# Altium project sar20-baseboard.PrjPcb (part 1 of 2)
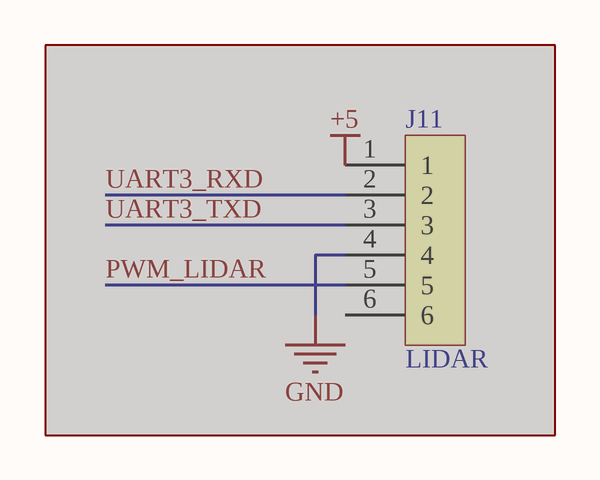
[diagram p0: sar20-baseboard.SchDoc]
6 sheets, 184 parts. Net scope: global (net labels, ports and power ports of the same name join across sheets).
Board files: sar20-baseboard.PcbDoc, sar20-baseboard-panel.PcbDoc
Sheets:
  sar20-baseboard.SchDoc
  sar20-baseboard-USB.SchDoc
  sar20-baseboard-SOM.SchDoc
  sar20-baseboard-MCU.SchDoc
  sar20-baseboard-Camera.SchDoc
  sar20-baseboard-Power.SchDoc

## Sheet sar20-baseboard.SchDoc
size A4

### Parts
J11  LIDAR  [MICRO-MATCH-FOB-SMD-06]  (masked out: inside a compile mask, not in the netlist)

### Library data of the parts
J11 = HEADER-6

## Sheet sar20-baseboard-USB.SchDoc
size A3
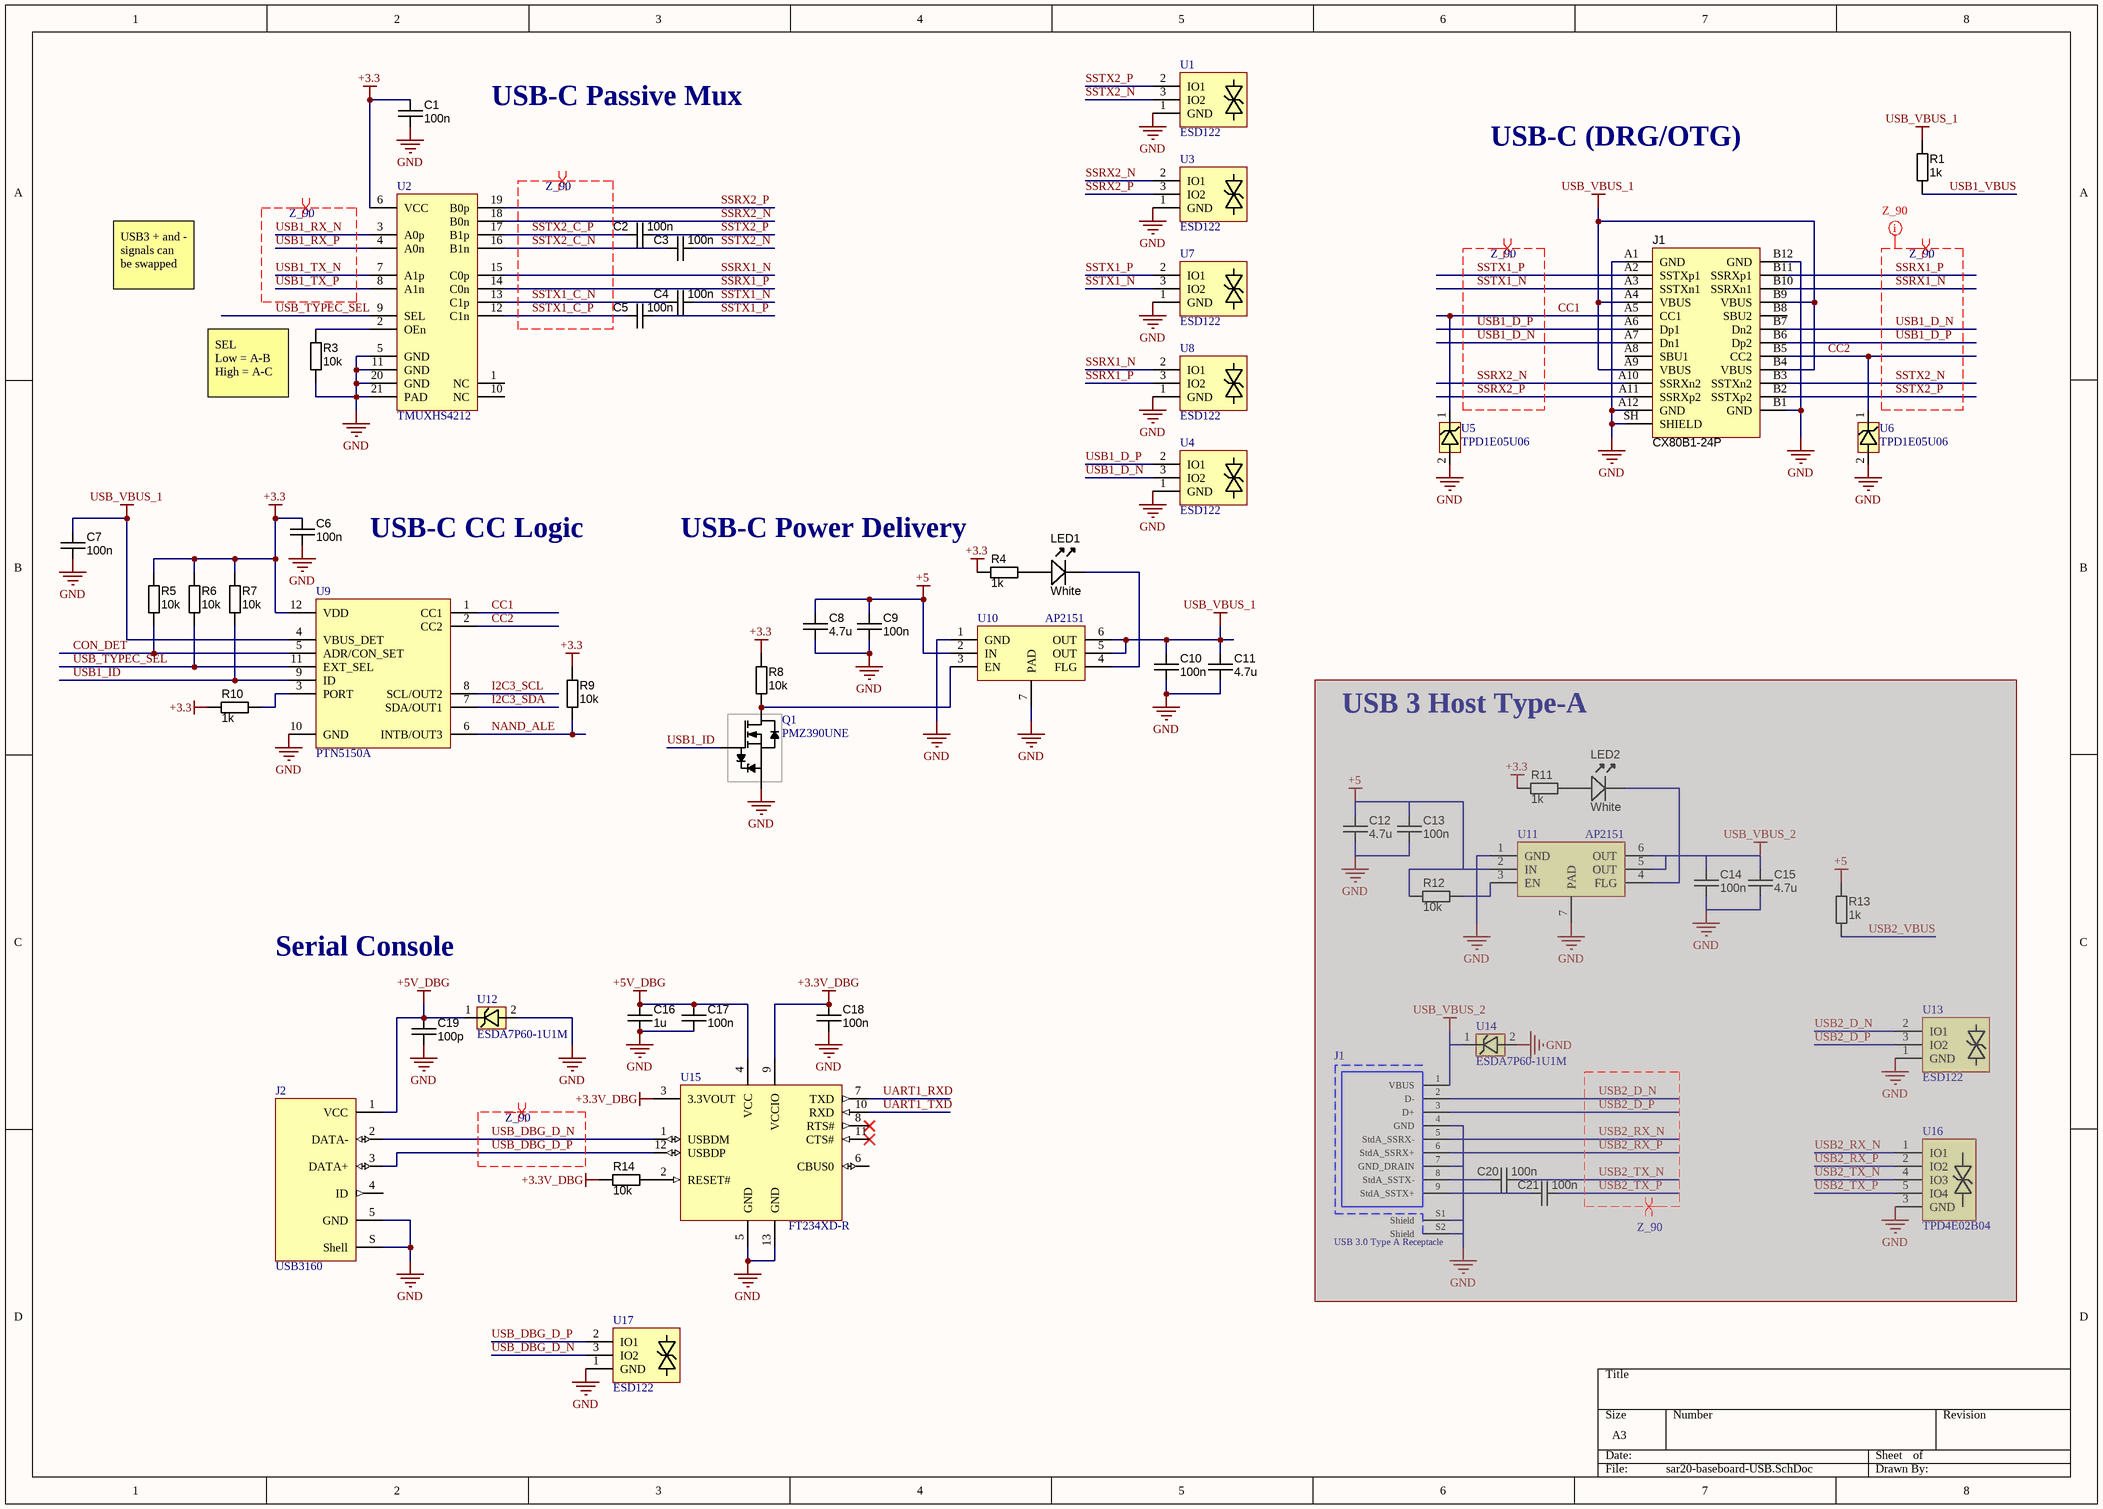
[diagram p1: sar20-baseboard-USB.SchDoc]

### Parts
(Parts that share a designator on the sheet are numbered #1, #2 ... from top to bottom, then left to right.)
C1  value 100n  [CAPC0603X04N]  (hidden comment: CAPC_100n_0201)
C2  value 100n  [CAPC0603X04N]  (hidden comment: CAPC_100n_0201)
C3  value 100n  [CAPC0603X04N]  (hidden comment: CAPC_100n_0201)
C4  value 100n  [CAPC0603X04N]  (hidden comment: CAPC_100n_0201)
C5  value 100n  [CAPC0603X04N]  (hidden comment: CAPC_100n_0201)
C6  100n  [CAPC1005X55N]
C7  100n  [CAPC1005X55N]
C8  value 4.7u  [CAPC1608X90N]  (hidden comment: approved sub OK)
C9  100n  [CAPC1005X55N]
C10  100n  [CAPC1005X55N]
C11  value 4.7u  [CAPC1608X90N]  (hidden comment: approved sub OK)
C12#1  value 4.7u  [CAPC1608X90N]  (hidden comment: approved sub OK)  (masked out: inside a compile mask, not in the netlist)
C13#1  100n  [CAPC1005X55N]  (masked out: inside a compile mask, not in the netlist)
C14#1  100n  [CAPC1005X55N]  (masked out: inside a compile mask, not in the netlist)
C15#1  value 4.7u  [CAPC1608X90N]  (hidden comment: approved sub OK)  (masked out: inside a compile mask, not in the netlist)
C16  1u  [CAPC1005X55N]
C17  value 100n  [CAPC0603X04N]  (hidden comment: CAPC_100n_0201)
C18  value 100n  [CAPC0603X04N]  (hidden comment: CAPC_100n_0201)
C19  value 100p  [CAPC0603X04N]  (hidden comment: CAPC_100n_0201)
C20#1  100n  [CAPC1005X55N]  (masked out: inside a compile mask, not in the netlist)
C21#1  100n  [CAPC1005X55N]  (masked out: inside a compile mask, not in the netlist)
J1#1  CX80B1-24P  [CX80B1-24P]
J1#2  USB 3.0 Type A Receptacle  [692121430000]  (masked out: inside a compile mask, not in the netlist)
J2  USB3160  [USB3160-XX-XXXX-X-X_revA]
LED1  White  [LED-0603-WHITE]
LED2  White  [LED-0603-WHITE]  (masked out: inside a compile mask, not in the netlist)
Q1  PMZ390UNE  [DFN1006-3_SOT883]
R1  value 1k  [RESC1005X40N]  (hidden comment: Thick Film)
R3  value 10k  [RESC1005X40N]  (hidden comment: Thick Film)
R4  value 1k  [RESC1005X40N]  (hidden comment: Thick Film)
R5  value 10k  [RESC1005X40N]  (hidden comment: Thick Film)
R6  value 10k  [RESC1005X40N]  (hidden comment: Thick Film)
R7  value 10k  [RESC1005X40N]  (hidden comment: Thick Film)
R8  value 10k  [RESC1005X40N]  (hidden comment: Thick Film)
R9  value 10k  [RESC1005X40N]  (hidden comment: Thick Film)
R10  value 1k  [RESC1005X40N]  (hidden comment: Thick Film)
R11#1  value 1k  [RESC1005X40N]  (hidden comment: Thick Film)  (masked out: inside a compile mask, not in the netlist)
R12#1  value 10k  [RESC1005X40N]  (hidden comment: Thick Film)  (masked out: inside a compile mask, not in the netlist)
R13#1  value 1k  [RESC1005X40N]  (hidden comment: Thick Film)  (masked out: inside a compile mask, not in the netlist)
R14  value 10k  [RESC0603X03N]  (hidden comment: RESC_0201)
U1  ESD122  [TI_X2SON_DMX0003A]
U2  TMUXHS4212  [TI_VQFN_RKS0020A]
U3  ESD122  [TI_X2SON_DMX0003A]
U4  ESD122  [TI_X2SON_DMX0003A]
U5  TPD1E05U06  [TI_X1SON_DPY]
U6  TPD1E05U06  [TI_X1SON_DPY]
U7  ESD122  [TI_X2SON_DMX0003A]
U8  ESD122  [TI_X2SON_DMX0003A]
U9  PTN5150A  [NXP_X2QFN12_SOT1355-1]
U10  AP2151  [SON50P200X60_HS-7N]
U11#1  AP2151  [SON50P200X60_HS-7N]  (masked out: inside a compile mask, not in the netlist)
U12  ESDA7P60-1U1M  [DFN105P160X60-2N]
U13#1  ESD122  [TI_X2SON_DMX0003A]  (masked out: inside a compile mask, not in the netlist)
U14#1  ESDA7P60-1U1M  [DFN105P160X60-2N]  (masked out: inside a compile mask, not in the netlist)
U15  FT234XD-R  [DFN-12_V]
U16#1  TPD4E02B04  [TI_USON10_DQA0010A_PASS]  (masked out: inside a compile mask, not in the netlist)
U17  ESD122  [TI_X2SON_DMX0003A]

### Nets
+3.3: C1.2 C6.1 R4.2 R5.2 R6.2 R7.2 R8.2 R9.2 R10.2 U2.6(VCC) U9.12(VDD)
+3.3V_DBG: C18.2 R14.1 U15.3(3.3VOUT) U15.9(VCCIO)
+5: C8.1 C9.1 U10.2(IN)
+5V_DBG: C16.1 C17.2 C19.2 J2.1(VCC) U12.1 U15.4(VCC)
GND: C1.1 C6.2 C7.2 C8.2 C9.2 C10.2 C11.2 C16.2 C17.1 C18.1 C19.1 J1#1.A1(GND) J1#1.A12(GND) J1#1.B1(GND) J1#1.B12(GND) J1#1.SH(SHIELD) J2.5(GND) J2.S(Shell) Q1.2(S) R3.1 U1.1(GND) U2.5(GND) U2.11(GND) U2.20(GND) U2.21(PAD) U3.1(GND) U4.1(GND) U5.2 U6.2 U7.1(GND) U8.1(GND) U9.10(GND) U10.1(GND) U10.7(PAD) U12.2 U15.5(GND) U15.13(GND) U17.1(GND)
USB_VBUS_1: C7.1 C10.1 C11.1 J1#1.A4(VBUS) J1#1.A9(VBUS) J1#1.B4(VBUS) J1#1.B9(VBUS) R1.2 U9.4(VBUS_DET) U10.5(OUT) U10.6(OUT)
CC1: J1#1.A5(CC1) U5.1 U9.1(CC1)
CC2: J1#1.B5(CC2) U6.1 U9.2(CC2)
CON_DET: R5.1 U9.5(ADR/CON_SET)
I2C3_SCL: U9.8(SCL/OUT2)
I2C3_SDA: U9.7(SDA/OUT1)
NAND_ALE: R9.1 U9.6(INTB/OUT3)
SSRX1_N: J1#1.B10(SSRXn1) U2.15(C0p) U8.2(IO1)
SSRX1_P: J1#1.B11(SSRXp1) U2.14(C0n) U8.3(IO2)
SSRX2_N: J1#1.A10(SSRXn2) U2.18(B0n) U3.2(IO1)
SSRX2_P: J1#1.A11(SSRXp2) U2.19(B0p) U3.3(IO2)
SSTX1_C_N: C4.1 U2.13(C1p)
SSTX1_C_P: C5.1 U2.12(C1n)
SSTX1_N: C4.2 J1#1.A3(SSTXn1) U7.3(IO2)
SSTX1_P: C5.2 J1#1.A2(SSTXp1) U7.2(IO1)
SSTX2_C_N: C3.1 U2.16(B1n)
SSTX2_C_P: C2.1 U2.17(B1p)
SSTX2_N: C3.2 J1#1.B3(SSTXn2) U1.3(IO2)
SSTX2_P: C2.2 J1#1.B2(SSTXp2) U1.2(IO1)
UART1_RXD: U15.7(TXD)
UART1_TXD: U15.10(RXD)
USB1_D_N: J1#1.A7(Dn1) J1#1.B7(Dn2) U4.3(IO2)
USB1_D_P: J1#1.A6(Dp1) J1#1.B6(Dp2) U4.2(IO1)
USB1_ID: Q1.1(G) R7.1 U9.9(ID)
USB1_RX_N: U2.3(A0p)
USB1_RX_P: U2.4(A0n)
USB1_TX_N: U2.7(A1p)
USB1_TX_P: U2.8(A1n)
USB1_VBUS: R1.1
USB_DBG_D_N: J2.2(DATA-) U15.1(USBDM) U17.3(IO2)
USB_DBG_D_P: J2.3(DATA+) U15.12(USBDP) U17.2(IO1)
USB_TYPEC_SEL: R6.1 U2.9(SEL) U9.11(EXT_SEL)
NetLED1_A: LED1.A R4.1
NetLED1_K: LED1.K U10.4(FLG)
NetQ1_3: Q1.3(D) R8.1 U10.3(EN)
NetR3_2: R3.2 U2.2(OEn)
NetR10_1: R10.1 U9.3(PORT)
NetR14_2: R14.2 U15.2(RESET#)

Not connected (* = marked no-connect by the designer): J1#1 A8(SBU1) B8(SBU2); J2 4(ID); U2 1(NC) 10(NC); U15 6(CBUS0) 8(RTS#)* 11(CTS#)*

### Layout directives
differential pair; differential pair class Z_90: SSRX1_N, SSRX1_P, SSRX2_N, SSRX2_P, SSTX1_C_N, SSTX1_C_P, SSTX1_N, SSTX1_P, SSTX2_C_N, SSTX2_C_P, SSTX2_N, SSTX2_P, USB1_D_N, USB1_D_P, USB1_RX_N, USB1_RX_P, USB1_TX_N, USB1_TX_P, USB2_D_N, USB2_D_P, USB2_RX_N, USB2_RX_P, USB2_TX_N, USB2_TX_P, USB_DBG_D_N, USB_DBG_D_P
net class Z_90: SSRX1_N, SSRX1_P, SSTX2_N, SSTX2_P, USB1_D_N, USB1_D_P

### Notes on the sheet
- USB-C Passive Mux
- USB-C (DRG/OTG)
- USB3 + and - signals can be swapped
- (near R3) SEL
  Low = A-B
  High = A-C
- USB-C CC Logic
- (near R4) USB-C Power Delivery
- USB 3 Host Type-A
- Serial Console

### Library data of the parts
C6 C7 C9 C10 C13#1 C14#1 C20#1 C21#1 = CAPC_100n_0402_X5R_16V_10%: Capacitor SMD Cer 100nF 10% 16V X5R 0402; Manufacturer 1: AVX Corporation; Manufacturer Part Number 1: 0402YD104KAT2A; Ratings: 16V; X5R; SCDType: spec; Tolerance: ±10%; Operating Temperature: -55°C ~ 125°C; Package / Case: 0402 (1005 Metric); Size / Dimension: 0.039" L x 0.020" W (1.00mm x 0.50mm); Supplier 1: Digi-Key; Supplier Part Number 1: 478-1126-1-ND; ComponentLink1URL: http://www.avx.com/docs/Catalogs/cx5r.pdf; ComponentLink1Description: http://www.avx.com/docs/Catalogs/cx5r.pdf; Supplier 2: Digi-Key; Supplier Part Number 2: 311-1347-1-ND; Manufacturer 2: Yageo; Manufacturer Part Number 2: CC0402KRX5R7BB104; ComponentLink2URL: http://www.yageo.com/documents/recent/UPY-GPHC_X5R_4V-to-50V_12.pdf; ComponentLink2Description: http://www.yageo.com/documents/recent/UPY-GPHC_X5R_4V-to-50V_12.pdf; Value: 100n
C8 C11 C12#1 C15#1 = CAPC_2u2_0603_10V_10%: Capacitor SMD Cer 2.2uF 10% 10V X5R 0603; Manufacturer 1: AVX Corporation; Manufacturer Part Number 1: 0603ZD225KAT2A; Ratings: 10V; X5R; Material: ceramic; SCDType: spec; Package / Case: 0603 (1608 metric); Tolerance: ±10%; Supplier 1: Digi-Key; Supplier Part Number 1: 478-6212-1-ND; ComponentLink1URL: http://www.avx.com/docs/Catalogs/cx5r.pdf; ComponentLink1Description: http://www.avx.com/docs/Catalogs/cx5r.pdf
C16 = CAPC_1u_0402_X5R_6V3_10%: Capacitor SMD Cer 1uF 10% 16V X5R 0402; Manufacturer 1: AVX Corporation; Manufacturer Part Number 1: 04026D105KAT2A; Ratings: 6.3V; X5R; SCDType: spec; Tolerance: ±10%; Operating Temperature: -55°C ~ 125°C; Package / Case: 0402 (1005 Metric); Size / Dimension: 0.039" L x 0.020" W (1.00mm x 0.50mm); Supplier 1: Digi-Key; Supplier Part Number 1: 478-2583-1-ND; RoHS 1: RoHS Compliant; ComponentLink1URL: http://www.avx.com/docs/Catalogs/cx5r.pdf; ComponentLink1Description: http://www.avx.com/docs/Catalogs/cx5r.pdf; Supplier 2: Digi-Key; Supplier Part Number 2: 311-1438-1-ND; Manufacturer 2: Yageo; Manufacturer Part Number 2: CC0402KRX5R5BB105; RoHS 2: RoHS Compliant; ComponentLink2URL: http://www.yageo.com/documents/recent/UPY-GPHC_X5R_4V-to-50V_12.pdf; ComponentLink2Description: http://www.yageo.com/documents/recent/UPY-GPHC_X5R_4V-to-50V_12.pdf; Supplier 3: Digi-Key; Supplier Part Number 3: 1276-1010-1-ND; Manufacturer 3: Samsung Electro-Mechanics America, Inc; Manufacturer Part Number 3: CL05A105KQ5NNNC; RoHS 3: RoHS Compliant; ComponentLink3URL: http://www.samsungsem.com/servlet/FileDownload?path=productsearch&sname=CL05A105KQ5NNNC.pdf&oname=CL05A105KQ5NNNC.pdf; ComponentLink3Description: http://www.samsungsem.com/servlet/FileDownload?path=productsearch&sname=CL05A105KQ5NNNC.pdf&oname=CL05A105KQ5NNNC.pdf; Supplier 4: Digi-Key; Supplier Part Number 4: 445-4998-1-ND; Manufacturer 4: TDK Corporation; Manufacturer Part Number 4: C1005X5R0J105K050BB; RoHS 4: RoHS Compliant; ComponentLink4URL: http://product.tdk.com/capacitor/mlcc/en/documents/mlcc_commercial_general_en.pdf; ComponentLink4Description: http://product.tdk.com/capacitor/mlcc/en/documents/mlcc_commercial_general_en.pdf; Supplier 5: Digi-Key; Supplier Part Number 5: 490-1320-1-ND; Manufacturer 5: Murata Electronics North America; Manufacturer Part Number 5: GRM155R60J105KE19D; RoHS 5: RoHS Compliant; ComponentLink5URL: http://www.murata.com/products/catalog/pdf/c02e.pdf; ComponentLink5Description: http://www.murata.com/products/catalog/pdf/c02e.pdf; Value: 1u
J1#2 = 692121430000: USB 3.0 Type A, Receptacle, Vertical, THT; Manufacturer: Wurth Elektronik; Rated Current: 1.8A; Pin Number: 9; Interface Type: Type A; Working Voltage: 30VAC; ComponentLink1Description: Manufacturer; ComponentLink1URL: http://www.we-online.de; ComponentLink2Description: Datasheet; ComponentLink2URL: https://katalog.we-online.com/em/datasheet/692121430000.pdf; Published Date: September 2019; Manufacturer Part Number: 692121430000; Gender: Receptacle; Type: Vertical; Packaging: Tray; Operating Temperature: -20 to +85degC; Mounting Technology: THT; Application: USB 3.0
J2 = USB3160-XX-XXXX-X-X_revA: Micro USB Receptacle, Type B, SMT, Vertical, with Locating Peg, with Through-Hole Shell Stakes
LED1 LED2 = LED_SMD_White_0603_Bright: LED 0603 SMD Bright White 8700K; Manufacturer 1: Lite-On Inc; Manufacturer Part Number 1: LTW-C193TS5; Material: InGaN; Ratings: Ultra Bright; 8700K; Millicandela Rating: 230mcd; Voltage - Forward (Vf) Typ: 3.3V; Viewing Angle: 120°; Lens Type: Clear, Tinted; Lens Style/Size: Rectangle with Flat Top, 0.8mm x 1.1mm; Voltage - Forward (Vf) @ 10mA: 3.0V; SCDType: source; Package / Case: 0603 (1608 metric); Supplier 1: Digi-Key; Supplier Part Number 1: 160-1721-1-ND; Supplier 2: Digi-Key; Supplier Part Number 2: APT1608QWF/D-ND; Manufacturer 2: Kingbright Corp; Manufacturer Part Number 2: APT1608QWF/D; Color: White; Size / Dimension: 1.60mm L x 0.80mm W; Mounting Type: Surface Mount; Luminous Flux @ Current - Test: -; ComponentLink2URL: http://www.kingbrightusa.com/images/catalog/SPEC/APT1608QWF-D.pdf; ComponentLink2Description: http://www.kingbrightusa.com/images/catalog/SPEC/APT1608QWF-D.pdf; ComponentLink1URL: http://media.digikey.com/pdf/Data%20Sheets/Lite-On%20PDFs/LTW-C193TS5.pdf; ComponentLink1Description: http://media.digikey.com/pdf/Data%20Sheets/Lite-On%20PDFs/LTW-C193TS5.pdf
R1 R3-R10 R11#1 R12#1 R13#1 = RES_10K_0402_1%: Resistor SMD chip 10k Ohm 0.063W 1% 0402; Manufacturer 1: Vishay Dale; Manufacturer Part Number 1: CRCW040210K0FKED; Ratings: 1/16 W; SCDType: spec; Package / Case: 0402 (1005 Metric); Manufacturer 2: Yageo; Manufacturer Part Number 2: RC0402FR-0710KL; Supplier 1: Digi-Key; Supplier Part Number 1: 541-10.0KLCT-ND; ComponentLink1URL: http://www.vishay.com/doc?20035; ComponentLink1Description: http://www.vishay.com/doc?20035; Supplier 2: Digi-Key; Supplier Part Number 2: 311-10.0KLRCT-ND; ComponentLink2URL: http://www.yageo.com/documents/recent/PYu-RC0402_51_RoHS_L_6.pdf; ComponentLink2Description: http://www.yageo.com/documents/recent/PYu-RC0402_51_RoHS_L_6.pdf; Tolerance: ±1%
U10 U11#1 = AP2151_DFN: USB optimized power switch by Diodes Inc
U15 = FT234XD-R: FT234XD USB to BASIC UART IC, -40 to +85 degC, 12-Pin DFN, Pb-Free, Tape and Reel; Manufacturer: FTDI; DatasheetVersion: ver 1.1, Feb-2013; PackageVersion: Feb-13; PackageReference: DFN-12; PackageDescription: 12-Pin Dual Flat No-Lead, 3 x 3 mm Body, 0.45 mm Pitch, Exposed Pad; PartNumber: FT234XD-R; ComponentLink1Description: Manufacturer URL; ComponentLink1URL: http://www.ftdichip.com/; ComponentLink2Description: Datasheet; ComponentLink2URL: http://www.ftdichip.com/Support/Documents/DataSheets/ICs/DS_FT234XD.pdf

## Sheet sar20-baseboard-SOM.SchDoc
size A3
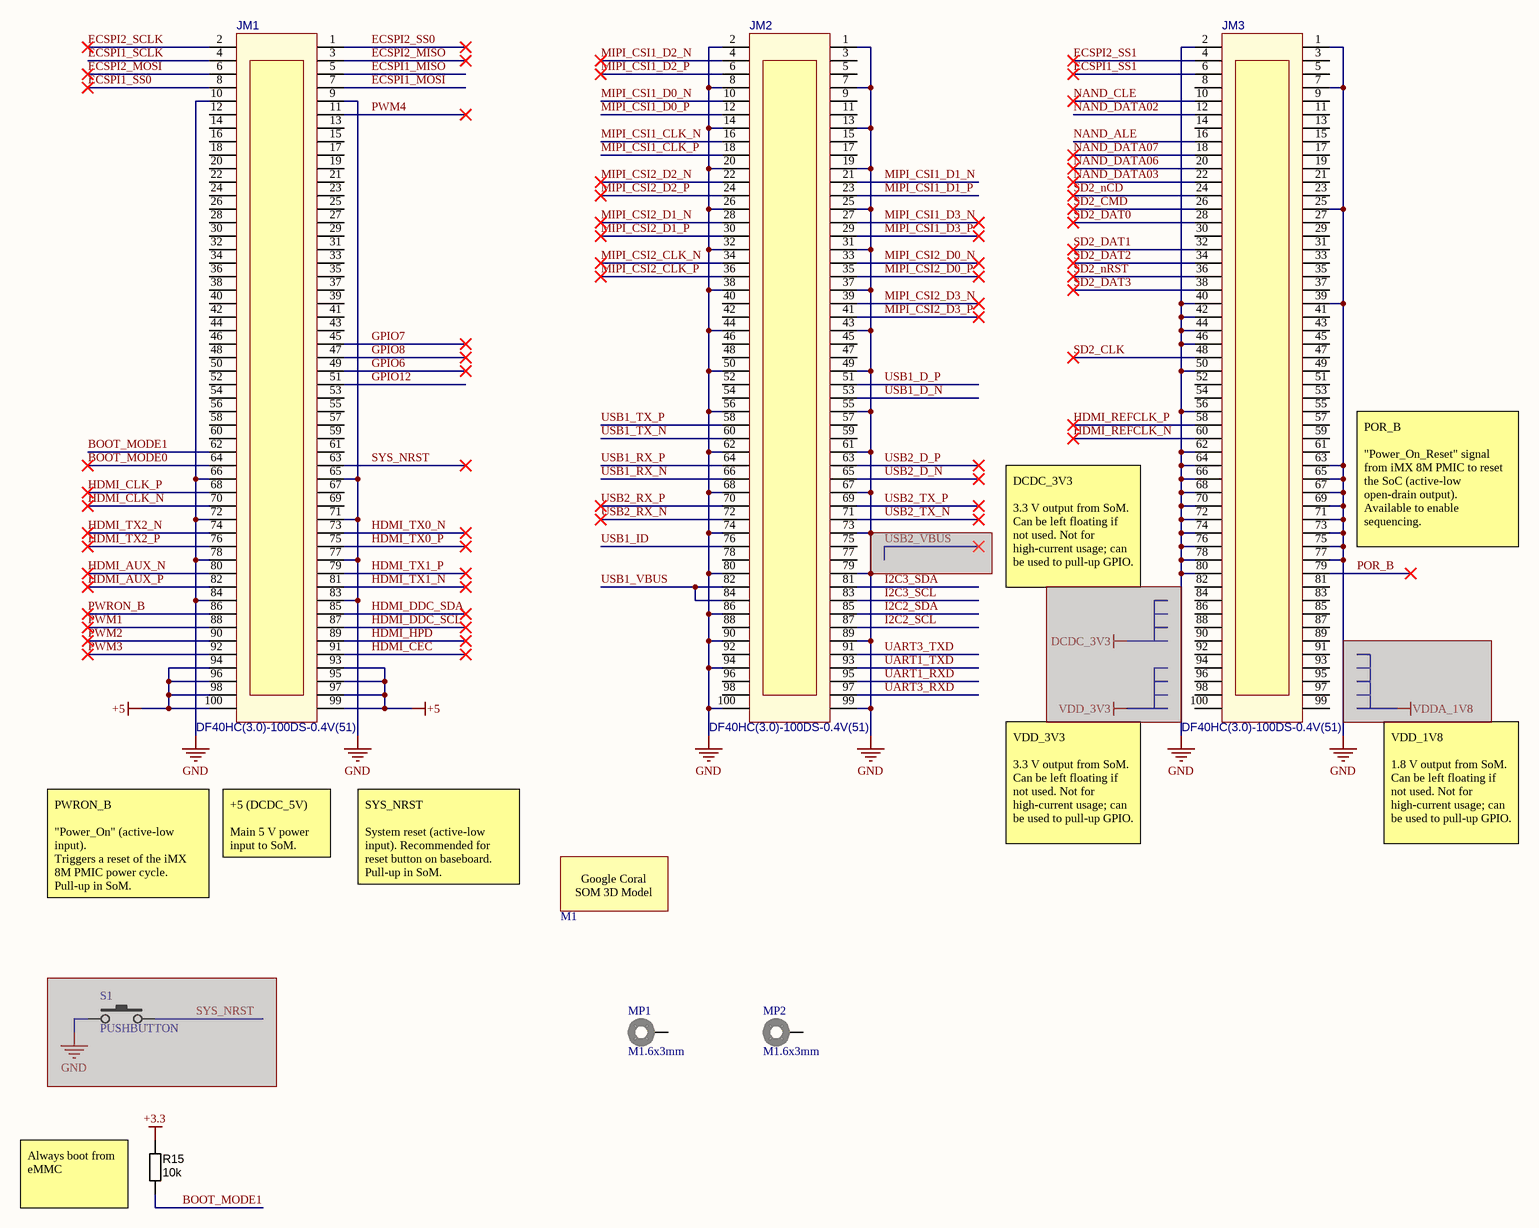
[diagram p2: sar20-baseboard-SOM.SchDoc]

### Parts
(Parts that share a designator on the sheet are numbered #1, #2 ... from top to bottom, then left to right.)
JM1  DF40HC(3.0)-100DS-0.4V(51)  [DF40HC(3.0)-100DS-0.4V(51)]
JM2  DF40HC(3.0)-100DS-0.4V(51)  [DF40HC(3.0)-100DS-0.4V(51)]
JM3  DF40HC(3.0)-100DS-0.4V(51)  [DF40HC(3.0)-100DS-0.4V(51)]
M1  Google Coral SOM  [CORAL-SOM]  (value not drawn)
MP1  M1.6x3mm  [9774030633]
MP2  M1.6x3mm  [9774030633]
R15  value 10k  [RESC1005X40N]  (hidden comment: Thick Film)
S1#1  PUSHBUTTON  [KMR421NGLFS]  (masked out: inside a compile mask, not in the netlist)

### Nets
+3.3: R15.1
+5: JM1.93(PB8) JM1.94(PB8) JM1.95(PB8) JM1.96(PB8) JM1.97(PB8) JM1.98(PB8) JM1.99(PB8) JM1.100(PB8)
GND: JM1.9(GND) JM1.10(PB15) JM1.65(PG6) JM1.66(BOOT1) JM1.71(PG12) JM1.72(PH12) JM1.77(GND) JM1.78(PI6) JM1.83(PB8) JM1.84(PB8) JM2.1(ETH_VDD) JM2.2 JM2.7(ETH_L1_C) JM2.8(GND) JM2.13(BATT_P) JM2.14(NRST) JM2.19(CHRG_NTC) JM2.20(PD14) JM2.25(PE8) JM2.26(PA8) JM2.31(PD5) JM2.32(PA10) JM2.37(PF0) JM2.38(PC11) JM2.43(PB3) JM2.44(PB4) JM2.49(PI2) JM2.50(BOOT0) JM2.55(PA11) JM2.56(PB7) JM2.61(PC7) JM2.62(PB12) JM2.67(PD3) JM2.68(PG11) JM2.73(PH13) JM2.74(PH8) JM2.79(PB8) JM2.80(ETH_R_N) JM2.86(PB8) JM2.89(PB8) JM2.90(PB8) JM2.94(PB8) JM2.99(PB8) JM2.100(PB8) JM3.1(ETH_VDD) JM3.2 JM3.7(ETH_L1_C) JM3.25(PE8) JM3.39(GND) JM3.40(PC12) JM3.42(PB10) JM3.44(PB4) JM3.46(PG9) JM3.50(BOOT0) JM3.56(PB7) JM3.62(PB12) JM3.63(PG7) JM3.64(GND) JM3.65(PG6) JM3.66(BOOT1) JM3.67(PD3) JM3.68(PG11) JM3.69(PG10) JM3.70(PH15) JM3.71(PG12) JM3.72(PH12) JM3.73(PH13) JM3.74(PH8) JM3.75(PH9) JM3.76(PI5) JM3.77(GND) JM3.78(PI6) JM3.80(ETH_R_N)
BOOT_MODE0: JM1.64(GND)
BOOT_MODE1: JM1.62(PB12) R15.2
ECSPI1_MISO: JM1.5(ETH_T_P)
ECSPI1_MOSI: JM1.7(ETH_L1_C)
ECSPI1_SCLK: JM1.4
ECSPI1_SS0: JM1.8(GND)
ECSPI1_SS1: JM3.6
ECSPI2_MISO: JM1.3(ETH_T_N)
ECSPI2_MOSI: JM1.6
ECSPI2_SCLK: JM1.2
ECSPI2_SS0: JM1.1(ETH_VDD)
ECSPI2_SS1: JM3.4
GPIO6: JM1.49(PI2)
GPIO7: JM1.45(PA14)
GPIO8: JM1.47(PA13)
GPIO12: JM1.51(PI3)
HDMI_AUX_N: JM1.80(ETH_R_N)
HDMI_AUX_P: JM1.82(PB8)
HDMI_CEC: JM1.91(PB8)
HDMI_CLK_N: JM1.70(PH15)
HDMI_CLK_P: JM1.68(PG11)
HDMI_DDC_SCL: JM1.87(PB8)
HDMI_DDC_SDA: JM1.85(PB8)
HDMI_HPD: JM1.89(PB8)
HDMI_REFCLK_N: JM3.60(PI1)
HDMI_REFCLK_P: JM3.58(PB5)
HDMI_TX0_N: JM1.73(PH13)
HDMI_TX0_P: JM1.75(PH9)
HDMI_TX1_N: JM1.81(PB8)
HDMI_TX1_P: JM1.79(PB8)
HDMI_TX2_N: JM1.74(PH8)
HDMI_TX2_P: JM1.76(PI5)
I2C2_SCL: JM2.87(PB8)
I2C2_SDA: JM2.85(PB8)
I2C3_SCL: JM2.83(PB8)
I2C3_SDA: JM2.81(PB8)
MIPI_CSI1_CLK_N: JM2.16(PE10)
MIPI_CSI1_CLK_P: JM2.18(PE9)
MIPI_CSI1_D0_N: JM2.10(PB15)
MIPI_CSI1_D0_P: JM2.12(PB14)
MIPI_CSI1_D1_N: JM2.21(1V8)
MIPI_CSI1_D1_P: JM2.23(PE7)
MIPI_CSI1_D2_N: JM2.4
MIPI_CSI1_D2_P: JM2.6
MIPI_CSI1_D3_N: JM2.27(PD1)
MIPI_CSI1_D3_P: JM2.29(PD0)
MIPI_CSI2_CLK_N: JM2.34(PC10)
MIPI_CSI2_CLK_P: JM2.36(PA15)
MIPI_CSI2_D0_N: JM2.33(PD4)
MIPI_CSI2_D0_P: JM2.35(PD7)
MIPI_CSI2_D1_N: JM2.28(GND)
MIPI_CSI2_D1_P: JM2.30(PA9)
MIPI_CSI2_D2_N: JM2.22(PD15)
MIPI_CSI2_D2_P: JM2.24(PC6)
MIPI_CSI2_D3_N: JM2.39(GND)
MIPI_CSI2_D3_P: JM2.41(RST_JTAG_O)
NAND_ALE: JM3.16(PE10)
NAND_CLE: JM3.10(PB15)
NAND_DATA02: JM3.12(PB14)
NAND_DATA03: JM3.22(PD15)
NAND_DATA06: JM3.20(PD14)
NAND_DATA07: JM3.18(PE9)
POR_B: JM3.79(PB8)
PWM1: JM1.88(PB8)
PWM2: JM1.90(PB8)
PWM3: JM1.92(PB8)
PWM4: JM1.11(BATT_P)
PWRON_B: JM1.86(PB8)
SD2_CLK: JM3.48(GND)
SD2_CMD: JM3.26(PA8)
SD2_DAT0: JM3.28(GND)
SD2_DAT1: JM3.32(PA10)
SD2_DAT2: JM3.34(PC10)
SD2_DAT3: JM3.38(PC11)
SD2_nCD: JM3.24(PC6)
SD2_nRST: JM3.36(PA15)
SYS_NRST: JM1.63(PG7)
UART1_RXD: JM2.95(PB8)
UART1_TXD: JM2.93(PB8)
UART3_RXD: JM2.97(PB8)
UART3_TXD: JM2.91(PB8)
USB1_D_N: JM2.53(PA12)
USB1_D_P: JM2.51(PI3)
USB1_ID: JM2.76(PI5)
USB1_RX_N: JM2.66(BOOT1)
USB1_RX_P: JM2.64(GND)
USB1_TX_N: JM2.60(PI1)
USB1_TX_P: JM2.58(PB5)
USB1_VBUS: JM2.82(PB8) JM2.84(PB8)
USB2_D_N: JM2.65(PG6)
USB2_D_P: JM2.63(PG7)
USB2_RX_N: JM2.72(PH12)
USB2_RX_P: JM2.70(PH15)
USB2_TX_N: JM2.71(PG12)
USB2_TX_P: JM2.69(PG10)

Not connected (* = marked no-connect by the designer): JM1 12(PB14) 13(BATT_P) 14(NRST) 15(USB_VBUS) 16(PE10) 17(USB_VBUS) 18(PE9) 19(CHRG_NTC) 20(PD14) 21(1V8) 22(PD15) 23(PE7) 24(PC6) 25(PE8) 26(PA8) 27(PD1) 28(GND) 29(PD0) 30(PA9) 31(PD5) 32(PA10) 33(PD4) 34(PC10) 35(PD7) 36(PA15) 37(PF0) 38(PC11) 39(GND) 40(PC12) 41(RST_JTAG_O) 42(PB10) 43(PB3) 44(PB4) 46(PG9) 48(GND) 50(BOOT0) 52(PC8) 53(PA12) 54(PB6) 55(PA11) 56(PB7) 57(PI0) 58(PB5) 59(PD6) 60(PI1) 61(PC7) 67(PD3) 69(PG10); JM2 3(ETH_T_N) 5(ETH_T_P) 9(GND) 11(BATT_P) 15(USB_VBUS) 17(USB_VBUS) 40(PC12) 42(PB10) 45(PA14) 46(PG9) 47(PA13) 48(GND) 52(PC8) 54(PB6) 57(PI0) 59(PD6) 75(PH9) 77(GND) 78(PI6) 88(PB8) 92(PB8) 96(PB8) 98(PB8); JM3 3(ETH_T_N) 5(ETH_T_P) 8(GND) 9(GND) 11(BATT_P) 13(BATT_P) 14(NRST) 15(USB_VBUS) 17(USB_VBUS) 19(CHRG_NTC) 21(1V8) 23(PE7) 27(PD1) 29(PD0) 30(PA9) 31(PD5) 33(PD4) 35(PD7) 37(PF0) 41(RST_JTAG_O) 43(PB3) 45(PA14) 47(PA13) 49(PI2) 51(PI3) 52(PC8) 53(PA12) 54(PB6) 55(PA11) 57(PI0) 59(PD6) 61(PC7) 81(PB8) 82(PB8) 83(PB8) 84(PB8) 85(PB8) 86(PB8) 87(PB8) 88(PB8) 89(PB8) 90(PB8) 91(PB8) 92(PB8) 93(PB8) 94(PB8) 95(PB8) 96(PB8) 97(PB8) 98(PB8) 99(PB8) 100(PB8); MP1 1; MP2 1

### Notes on the sheet
- DCDC_3V3
  3.3 V output from SoM. Can be left floating if not used. Not for high-current usage; can be used to pull-up GPIO.
- POR_B
  "Power_On_Reset" signal from iMX 8M PMIC to reset the SoC (active-low open-drain output).
  Available to enable sequencing.
- +5 (DCDC_5V)
  Main 5 V power input to SoM.
  Must be connected.
- VDD_3V3
  3.3 V output from SoM. Can be left floating if not used. Not for high-current usage; can be used to pull-up GPIO.
- VDD_1V8
  1.8 V output from SoM. Can be left floating if not used. Not for high-current usage; can be used to pull-up GPIO.
- PWRON_B
  "Power_On" (active-low input).
  Triggers a reset of the iMX 8M PMIC power cycle. Pull-up in SoM.
- SYS_NRST
  System reset (active-low input). Recommended for reset button on baseboard.
  Pull-up in SoM.
- (near R15) Always boot from eMMC
- (in symbol CORAL-SOM-3D-MODEL) Google Coral SOM 3D Model

### Library data of the parts
JM1-JM3 = DF40HC(3.0)-100DS-0.4V(51): CONN RCPT 100POS 0.4MM SMD GOLD; Manufacturer: Hirose; PartNumber: DF40HC(3.0)-100DS-0.4V(51); Value: DF40HC(3.0)-100DS-0.4V(51)
M1 = CORAL-SOM-3D-MODEL
MP1 MP2 = 9774030633: WA-SMSI SMT Steel Spacer, M1.6 Thread Internal, OD 3.3mm, M1.6x3mm; Manufacturer: Wurth Elektronik; Inner Diameter: 1.9mm; Surface: Tin; ComponentLink1Description: Manufacturer; ComponentLink1URL: http://www.we-online.de; ComponentLink2Description: Datasheet; ComponentLink2URL: https://www.we-online.com/catalog/datasheet/9774030633.pdf; Mounting Technology: SMT; Packaging: Bulk; Manufacturer Part Number: 9774030633; Length: 3mm; Inner Thread Length: -; Operating Temperature: -55 to +150degC; Outer Diameter: 3.3mm; Published Date: April 2020; Material: Steel; Thread: M1.6
R15 = RES_10K_0402_1%: as R1 on sheet sar20-baseboard-USB; Package / Case: 0402 (1005 Metric); Manufacturer 2: Yageo; Manufacturer Part Number 2: RC0402FR-0710KL; Supplier 1: Digi-Key; Supplier Part Number 1: 541-10.0KLCT-ND; ComponentLink1URL: http://www.vishay.com/doc?20035; ComponentLink1Description: http://www.vishay.com/doc?20035; Supplier 2: Digi-Key; Supplier Part Number 2: 311-10.0KLRCT-ND; ComponentLink2URL: http://www.yageo.com/documents/recent/PYu-RC0402_51_RoHS_L_6.pdf; ComponentLink2Description: http://www.yageo.com/documents/recent/PYu-RC0402_51_RoHS_L_6.pdf; Tolerance: ±1%

## Sheet sar20-baseboard-MCU.SchDoc
size A3
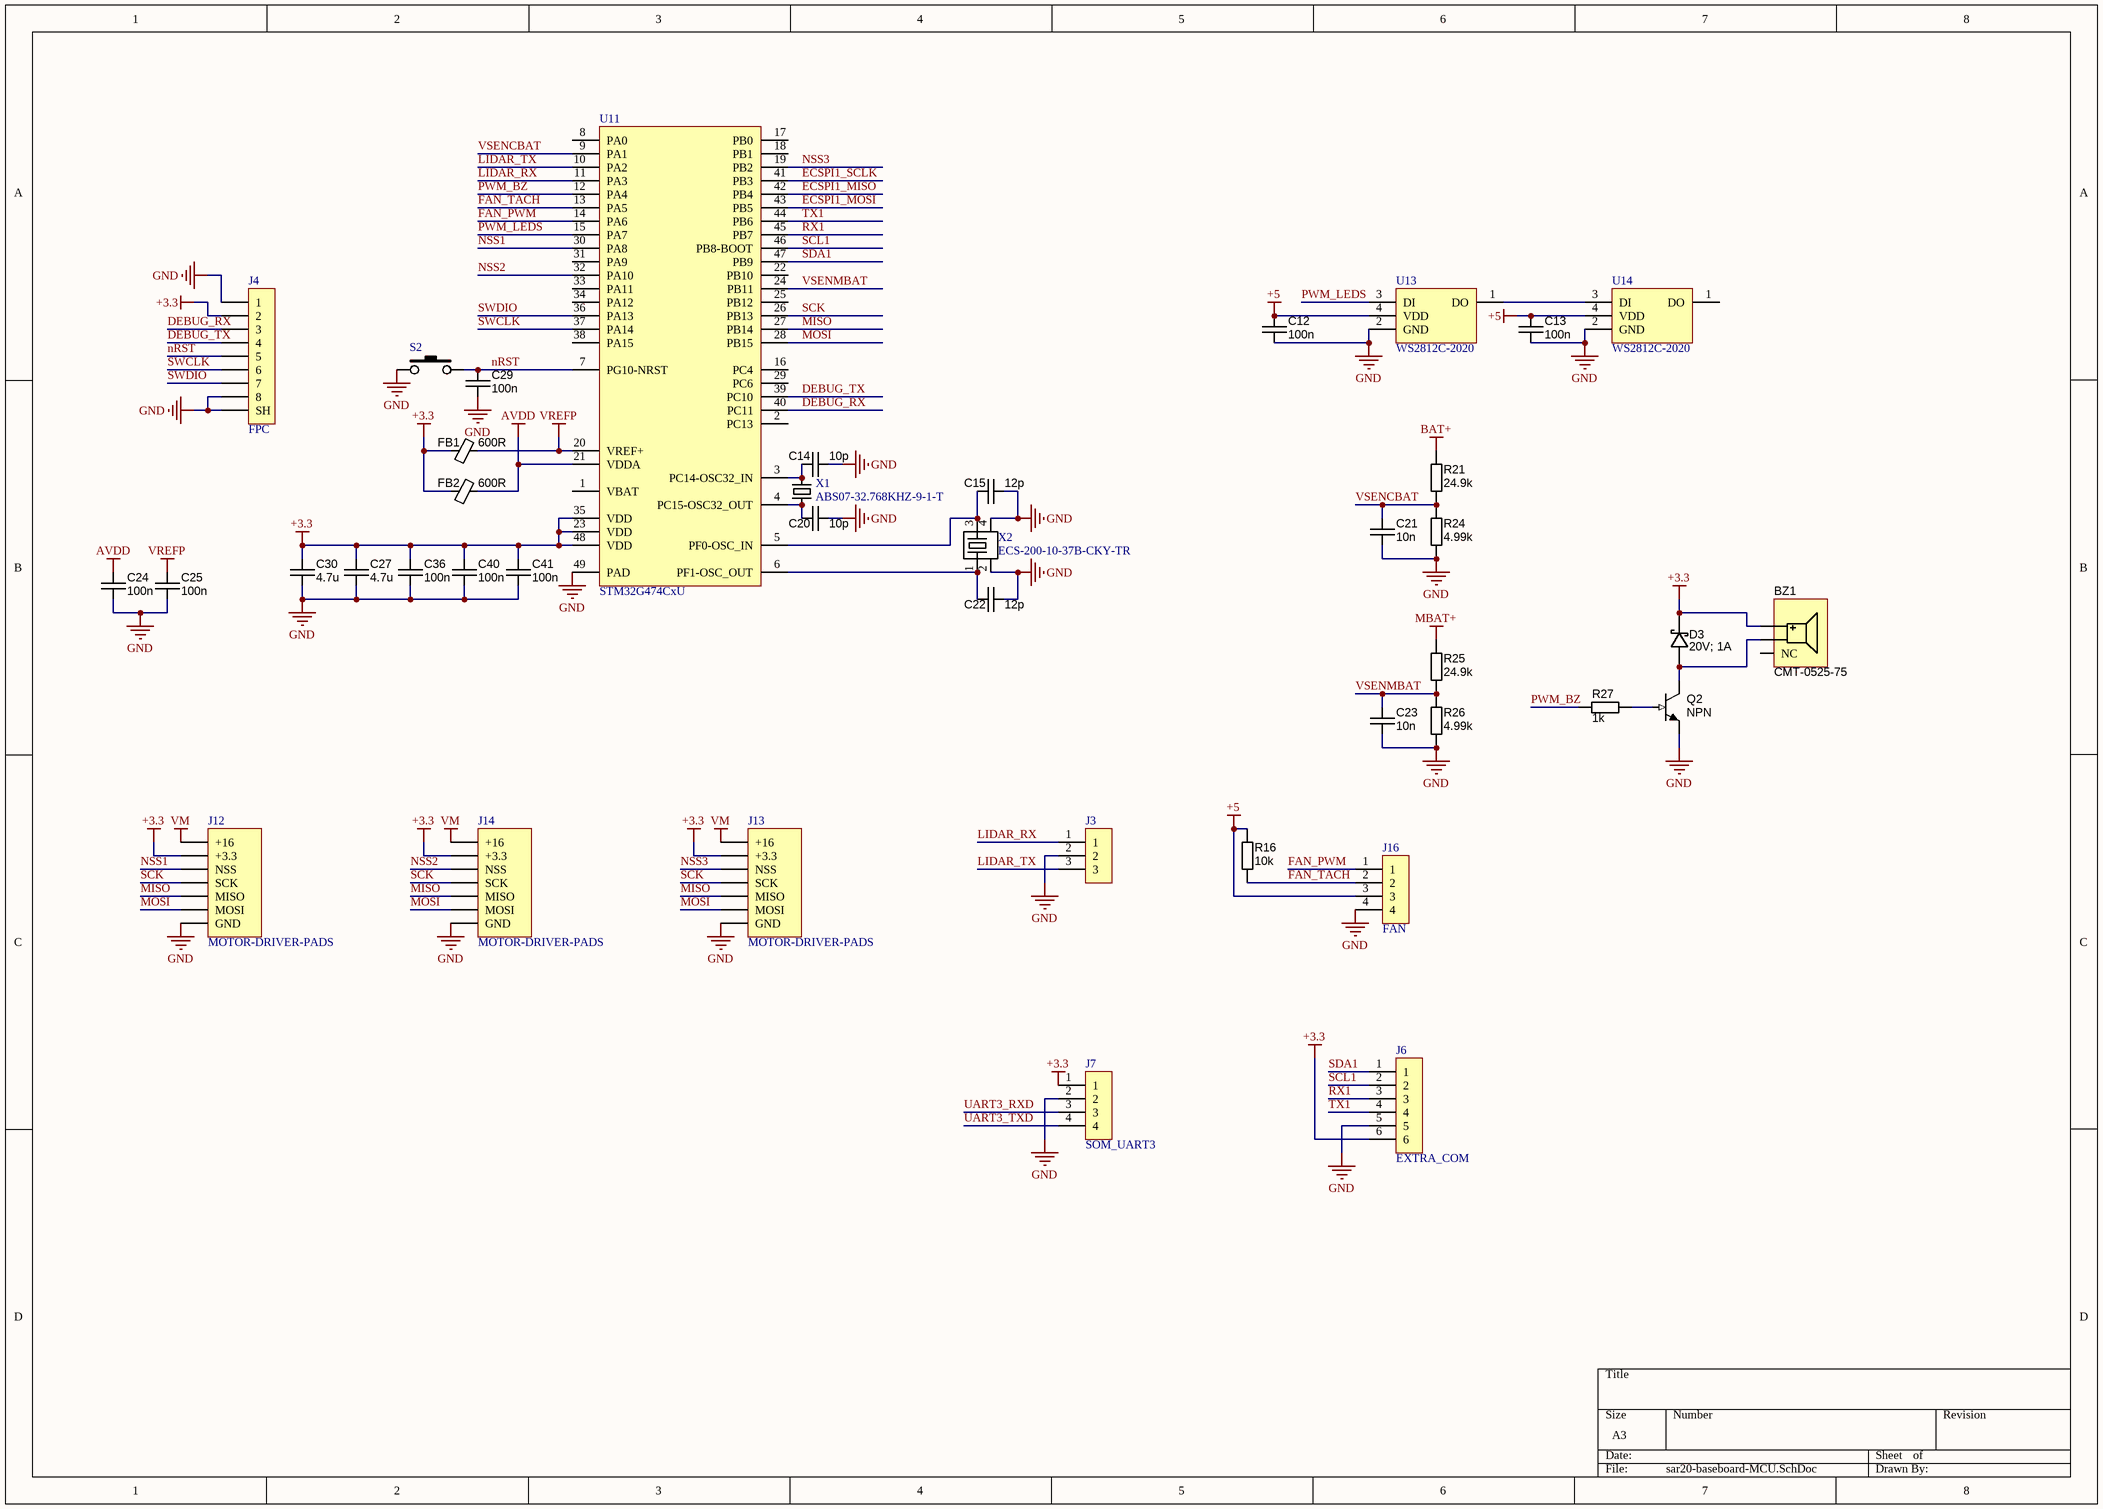
[diagram p3: sar20-baseboard-MCU.SchDoc]

### Parts
(Parts that share a designator on the sheet are numbered #1, #2 ... from top to bottom, then left to right.)
BZ1  CMT-0525-75  [CMT-0525-75]
C12#2  100n  [CAPC1005X55N]
C13#2  100n  [CAPC1005X55N]
C14#2  value 10p  [CAPC0603X04N]  (hidden comment: CAPC_100n_0201)
C15#2  value 12p  [CAPC0603X04N]  (hidden comment: CAPC_100n_0201)
C20#2  value 10p  [CAPC0603X04N]  (hidden comment: CAPC_100n_0201)
C21#2  value 10n  [CAPC0603X04N]  (hidden comment: CAPC_100n_0201)
C22  value 12p  [CAPC0603X04N]  (hidden comment: CAPC_100n_0201)
C23  value 10n  [CAPC0603X04N]  (hidden comment: CAPC_100n_0201)
C24  value 100n  [CAPC0603X04N]  (hidden comment: CAPC_100n_0201)
C25  value 100n  [CAPC0603X04N]  (hidden comment: CAPC_100n_0201)
C27  value 4.7u  [CAPC1608X90N]  (hidden comment: approved sub OK)
C29  value 100n  [CAPC0603X04N]  (hidden comment: CAPC_100n_0201)
C30  value 4.7u  [CAPC1608X90N]  (hidden comment: approved sub OK)
C36  100n  [CAPC1005X55N]
C40  100n  [CAPC1005X55N]
C41  100n  [CAPC1005X55N]
D3  20V; 1A  [SOD123]
FB1  value 600R  [INDC1005X06N]  (hidden comment: Ferrite Bead)
FB2  value 600R  [INDC1005X06N]  (hidden comment: Ferrite Bead)
J3  MOLEX_PICOBLADE_530470310  [MOLEX_PICOBLADE_530470310]  (value not drawn)
J4  FPC  [HIROSE-FH19C-8S-0.5SH]
J6  EXTRA_COM  [MOLEX_PICOBLADE_530470610]
J7  SOM_UART3  [MOLEX_PICOBLADE_530470410]
J12  MOTOR-DRIVER-PADS  [MOTOR-DRIVER-PADS]  (no BOM)
J13  MOTOR-DRIVER-PADS  [MOTOR-DRIVER-PADS]  (no BOM)
J14  MOTOR-DRIVER-PADS  [MOTOR-DRIVER-PADS]  (no BOM)
J16  FAN  [MOLEX_PICOBLADE_530470410]
Q2  NPN  [SOT23-3]
R16  value 10k  [RESC1005X40N]  (hidden comment: Thick Film)
R21  value 24.9k  [RESC1005X40N]  (hidden comment: Thick Film)
R24  value 4.99k  [RESC1005X40N]  (hidden comment: Thick Film)
R25  value 24.9k  [RESC1005X40N]  (hidden comment: Thick Film)
R26  value 4.99k  [RESC1005X40N]  (hidden comment: Thick Film)
R27  value 1k  [RESC1005X40N]  (hidden comment: Thick Film)
S2  PUSHBUTTON  [KMR421NGLFS]  (value not drawn)
U11#2  STM32G474CxU  [QFN50P700X700X60_HS-49N]
U13#2  WS2812C-2020  [WS2812C-2020]
U14#2  WS2812C-2020  [WS2812C-2020]
X1  ABS07-32.768KHZ-9-1-T  [XTAL-3.2x1.5]
X2  ECS-200-10-37B-CKY-TR  [XTAL-2.0X1.6]

### Nets
+3.3: BZ1.1(Positive) C27.1 C30.1 C36.1 C40.1 C41.1 D3.K FB1.1 FB2.1 J4.2 J6.6 J7.1 J12.+3.3 J13.+3.3 J14.+3.3 U11#2.23(VDD) U11#2.35(VDD) U11#2.48(VDD)
+5: C12#2.2 C13#2.1 J16.3 R16.1 U13#2.4(VDD) U14#2.4(VDD)
AVDD: C24.2 FB2.2 U11#2.21(VDDA)
BAT+: R21.1
GND: C12#2.1 C13#2.2 C14#2.1 C15#2.1 C20#2.1 C21#2.1 C22.1 C23.1 C24.1 C25.1 C27.2 C29.1 C30.2 C36.2 C40.2 C41.2 J3.2 J4.1 J4.8 J4.SH J6.5 J7.2 J12.GND J13.GND J14.GND J16.4 Q2.2(E) R24.2 R26.2 S2.1 U11#2.49(PAD) U13#2.2(GND) U14#2.2(GND) X2.2 X2.4
MBAT+: R25.1
VM: J12.+16 J13.+16 J14.+16
VREFP: C25.2 FB1.2 U11#2.20(VREF+)
DEBUG_RX: J4.3 U11#2.40(PC11)
DEBUG_TX: J4.4 U11#2.39(PC10)
ECSPI1_MISO: U11#2.42(PB4)
ECSPI1_MOSI: U11#2.43(PB5)
ECSPI1_SCLK: U11#2.41(PB3)
FAN_PWM: J16.1 U11#2.14(PA6)
FAN_TACH: J16.2 R16.2 U11#2.13(PA5)
LIDAR_RX: J3.1 U11#2.11(PA3)
LIDAR_TX: J3.3 U11#2.10(PA2)
MISO: J12.MISO J13.MISO J14.MISO U11#2.27(PB14)
MOSI: J12.MOSI J13.MOSI J14.MOSI U11#2.28(PB15)
nRST: C29.2 J4.5 S2.2 U11#2.7(PG10-NRST)
NSS1: J12.NSS U11#2.30(PA8)
NSS2: J14.NSS U11#2.32(PA10)
NSS3: J13.NSS U11#2.19(PB2)
PWM_BZ: R27.1 U11#2.12(PA4)
PWM_LEDS: U11#2.15(PA7) U13#2.3(DI)
RX1: J6.3 U11#2.45(PB7)
SCK: J12.SCK J13.SCK J14.SCK U11#2.26(PB13)
SCL1: J6.2 U11#2.46(PB8-BOOT)
SDA1: J6.1 U11#2.47(PB9)
SWCLK: J4.6 U11#2.37(PA14)
SWDIO: J4.7 U11#2.36(PA13)
TX1: J6.4 U11#2.44(PB6)
UART3_RXD: J7.3
UART3_TXD: J7.4
VSENCBAT: C21#2.2 R21.2 R24.1 U11#2.9(PA1)
VSENMBAT: C23.2 R25.2 R26.1 U11#2.24(PB11)
NetBZ1_2: BZ1.2(Negative) D3.A Q2.3(C)
NetC14#2_2: C14#2.2 U11#2.3(PC14-OSC32_IN) X1.2
NetC15#2_2: C15#2.2 U11#2.5(PF0-OSC_IN) X2.3
NetC20#2_2: C20#2.2 U11#2.4(PC15-OSC32_OUT) X1.1
NetC22_2: C22.2 U11#2.6(PF1-OSC_OUT) X2.1
NetQ2_1: Q2.1(B) R27.2
NetU13#2_1: U13#2.1(DO) U14#2.3(DI)

Not connected (* = marked no-connect by the designer): BZ1 3(NC); U11#2 1(VBAT) 2(PC13) 8(PA0) 16(PC4) 17(PB0) 18(PB1) 22(PB10) 25(PB12) 29(PC6) 31(PA9) 33(PA11) 34(PA12) 38(PA15); U14#2 1(DO)

### Library data of the parts
C12#2 C13#2 C36 C40 C41 = CAPC_100n_0402_X5R_16V_10%: as C6 on sheet sar20-baseboard-USB; Tolerance: ±10%; Operating Temperature: -55°C ~ 125°C; Package / Case: 0402 (1005 Metric); Size / Dimension: 0.039" L x 0.020" W (1.00mm x 0.50mm); Supplier 1: Digi-Key; Supplier Part Number 1: 478-1126-1-ND; ComponentLink1URL: http://www.avx.com/docs/Catalogs/cx5r.pdf; ComponentLink1Description: http://www.avx.com/docs/Catalogs/cx5r.pdf; Supplier 2: Digi-Key; Supplier Part Number 2: 311-1347-1-ND; Manufacturer 2: Yageo; Manufacturer Part Number 2: CC0402KRX5R7BB104; ComponentLink2URL: http://www.yageo.com/documents/recent/UPY-GPHC_X5R_4V-to-50V_12.pdf; ComponentLink2Description: http://www.yageo.com/documents/recent/UPY-GPHC_X5R_4V-to-50V_12.pdf; Value: 100n
C27 C30 = CAPC_2u2_0603_10V_10%: as C8 on sheet sar20-baseboard-USB; Package / Case: 0603 (1608 metric); Tolerance: ±10%; Supplier 1: Digi-Key; Supplier Part Number 1: 478-6212-1-ND; ComponentLink1URL: http://www.avx.com/docs/Catalogs/cx5r.pdf; ComponentLink1Description: http://www.avx.com/docs/Catalogs/cx5r.pdf
D3 = DIODE_SCHOTTKY_40V_1A: Diode Schottky SMD 20V 1A SOD123; Manufacturer 1: Diodes Inc; Manufacturer Part Number 1: 1N5819HW-7-F; Ratings: 40V; 1A; Material: Si; SCDType: spec; Package / Case: SOD123; Diode Type: Schottky; Mounting Type: Surface Mount; Supplier 1: Digi-Key; Supplier Part Number 1: 1N5819HW-FDICT-ND
FB1 FB2 = FERRITE_BEAD
J4 = FPC-CONNECTOR-8
J6 = MOLEX_PICOBLADE_530470610
J7 J16 = MOLEX_PICOBLADE_530470410
Q2 = NPN_FMMT617TA: Transistor SMD NPN 15V 3A SOT-23; Manufacturer 1: Diodes/Zetex; Ratings: 15V; 3A; 625mW; SCDType: spec; Supplier 1: Digi-Key; Supplier Part Number 1: FMMT617CT-ND; Package / Case: SOT-23; Manufacturer Part Number 1: FMMT617TA
R16 R21 R24-R27 = RES_10K_0402_1%: as R1 on sheet sar20-baseboard-USB; Package / Case: 0402 (1005 Metric); Manufacturer 2: Yageo; Manufacturer Part Number 2: RC0402FR-0710KL; Supplier 1: Digi-Key; Supplier Part Number 1: 541-10.0KLCT-ND; ComponentLink1URL: http://www.vishay.com/doc?20035; ComponentLink1Description: http://www.vishay.com/doc?20035; Supplier 2: Digi-Key; Supplier Part Number 2: 311-10.0KLRCT-ND; ComponentLink2URL: http://www.yageo.com/documents/recent/PYu-RC0402_51_RoHS_L_6.pdf; ComponentLink2Description: http://www.yageo.com/documents/recent/PYu-RC0402_51_RoHS_L_6.pdf; Tolerance: ±1%
X1 = XTAL-3.2x1.5
X2 = XTAL-2.0x1.6

## Sheet sar20-baseboard-Camera.SchDoc
size A4
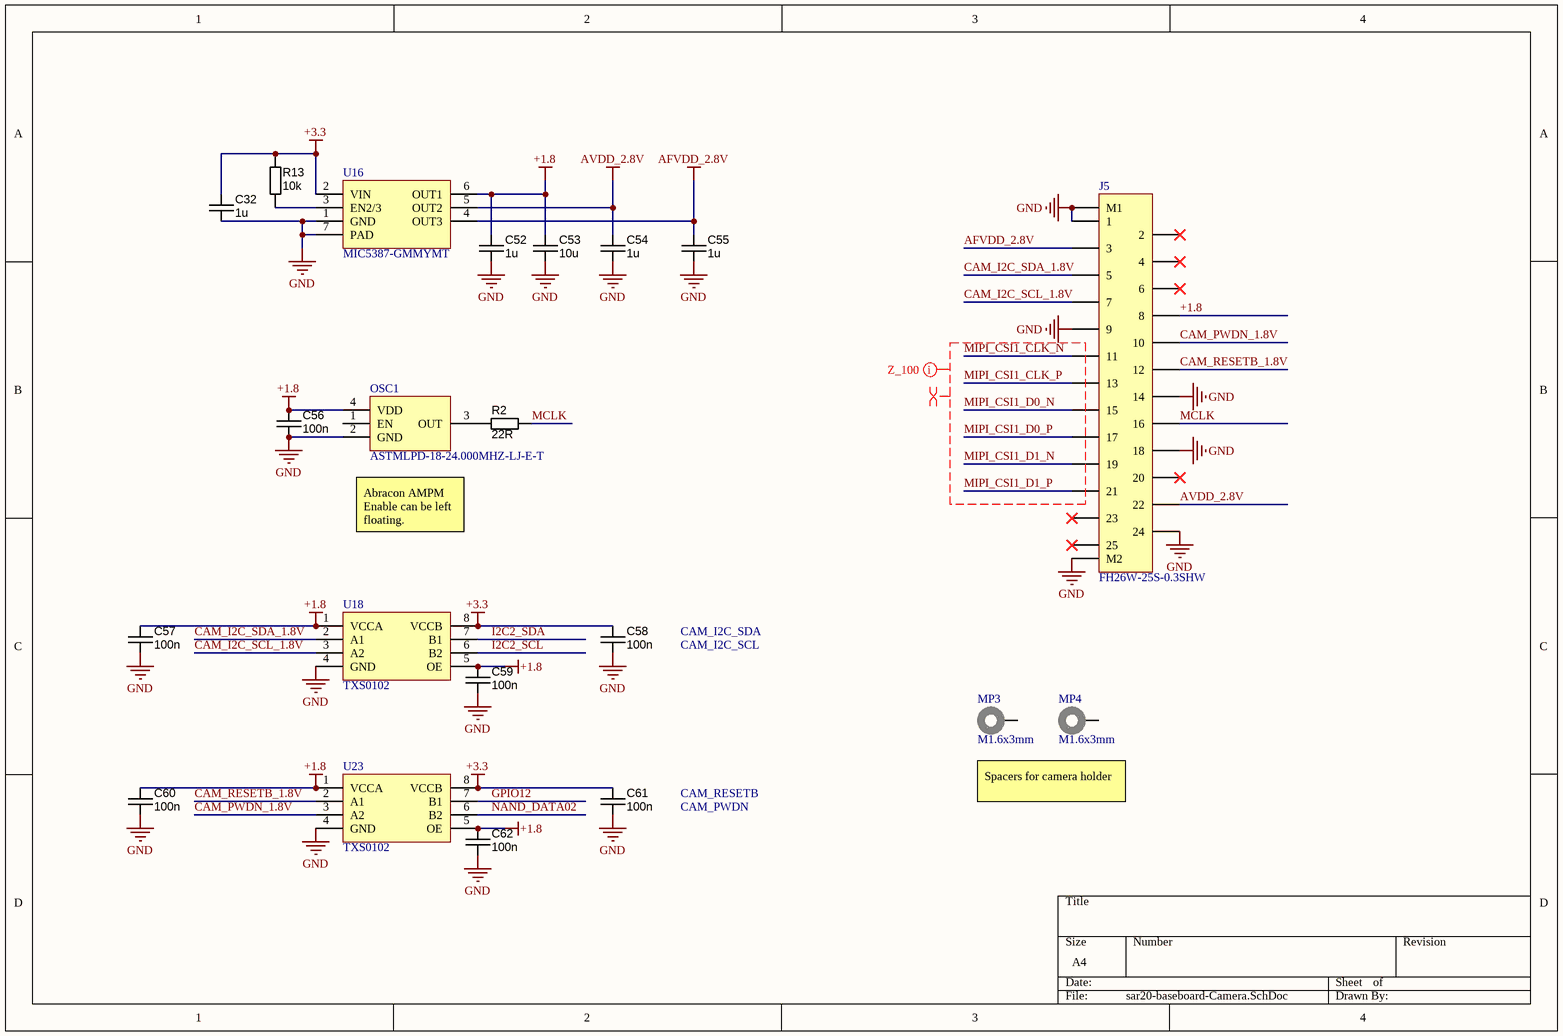
[diagram p4: sar20-baseboard-Camera.SchDoc]

### Parts
(Parts that share a designator on the sheet are numbered #1, #2 ... from top to bottom, then left to right.)
C32  1u  [CAPC1005X55N]
C52  1u  [CAPC1005X55N]
C53  value 10u  [CAPC1608X90N]  (hidden comment: approved sub OK)
C54  1u  [CAPC1005X55N]
C55  1u  [CAPC1005X55N]
C56  100n  [CAPC1005X55N]
C57  100n  [CAPC1005X55N]
C58  100n  [CAPC1005X55N]
C59  100n  [CAPC1005X55N]
C60  100n  [CAPC1005X55N]
C61  100n  [CAPC1005X55N]
C62  100n  [CAPC1005X55N]
J5  FH26W-25S-0.3SHW  [FH26W-25S-0.3SHW]
MP3  M1.6x3mm  [9774030633]
MP4  M1.6x3mm  [9774030633]
OSC1  ASTMLPD-18-24.000MHZ-LJ-E-T  [Abracon_AMPM_2.5x2.0]
R2  value 22R  [RESC1005X40N]  (hidden comment: Thick Film)
R13#2  value 10k  [RESC1005X40N]  (hidden comment: Thick Film)
U16#2  MIC5387-GMMYMT  [SON50P160X60_HS-7N]
U18  TXS0102  [TI_X2SON_DQM]
U23  TXS0102  [TI_X2SON_DQM]

### Nets
+1.8: C52.1 C53.1 C56.1 C57.1 C59.1 C60.1 C62.1 J5.8 OSC1.4(VDD) U16#2.6(OUT1) U18.1(VCCA) U18.5(OE) U23.1(VCCA) U23.5(OE)
+3.3: C32.1 C58.1 C61.1 R13#2.1 U16#2.2(VIN) U18.8(VCCB) U23.8(VCCB)
AFVDD_2.8V: C55.1 J5.3 U16#2.4(OUT3)
AVDD_2.8V: C54.1 J5.22 U16#2.5(OUT2)
GND: C32.2 C52.2 C53.2 C54.2 C55.2 C56.2 C57.2 C58.2 C59.2 C60.2 C61.2 C62.2 J5.1 J5.9 J5.14 J5.18 J5.24 J5.M1 J5.M2 OSC1.2(GND) U16#2.1(GND) U16#2.7(PAD) U18.4(GND) U23.4(GND)
CAM_I2C_SCL_1.8V: J5.7 U18.3(A2)
CAM_I2C_SDA_1.8V: J5.5 U18.2(A1)
CAM_PWDN_1.8V: J5.10 U23.3(A2)
CAM_RESETB_1.8V: J5.12 U23.2(A1)
GPIO12: U23.7(B1)
I2C2_SCL: U18.6(B2)
I2C2_SDA: U18.7(B1)
MCLK: J5.16 R2.2
MIPI_CSI1_CLK_N: J5.11
MIPI_CSI1_CLK_P: J5.13
MIPI_CSI1_D0_N: J5.15
MIPI_CSI1_D0_P: J5.17
MIPI_CSI1_D1_N: J5.19
MIPI_CSI1_D1_P: J5.21
NAND_DATA02: U23.6(B2)
NetOSC1_3: OSC1.3(OUT) R2.1
NetR13#2_2: R13#2.2 U16#2.3(EN2/3)

Not connected (* = marked no-connect by the designer): J5 2* 4* 6* 20* 23* 25*; MP3 1; MP4 1; OSC1 1(EN)

### Layout directives
differential pair; differential pair class Z_100: MIPI_CSI1_CLK_N, MIPI_CSI1_CLK_P, MIPI_CSI1_D0_N, MIPI_CSI1_D0_P, MIPI_CSI1_D1_N, MIPI_CSI1_D1_P
net class Z_100: MIPI_CSI1_CLK_N, MIPI_CSI1_CLK_P, MIPI_CSI1_D0_N, MIPI_CSI1_D0_P, MIPI_CSI1_D1_N, MIPI_CSI1_D1_P

### Notes on the sheet
- Abracon AMPM
  Enable can be left floating.
- CAM_I2C_SCL
- CAM_I2C_SDA
- CAM_PWDN
- CAM_RESETB
- Spacers for camera holder

### Library data of the parts
C32 C52 C54 C55 = CAPC_1u_0402_X5R_6V3_10%: as C16 on sheet sar20-baseboard-USB; Tolerance: ±10%; Operating Temperature: -55°C ~ 125°C; Package / Case: 0402 (1005 Metric); Size / Dimension: 0.039" L x 0.020" W (1.00mm x 0.50mm); Supplier 1: Digi-Key; Supplier Part Number 1: 478-2583-1-ND; RoHS 1: RoHS Compliant; ComponentLink1URL: http://www.avx.com/docs/Catalogs/cx5r.pdf; ComponentLink1Description: http://www.avx.com/docs/Catalogs/cx5r.pdf; Supplier 2: Digi-Key; Supplier Part Number 2: 311-1438-1-ND; Manufacturer 2: Yageo; Manufacturer Part Number 2: CC0402KRX5R5BB105; RoHS 2: RoHS Compliant; ComponentLink2URL: http://www.yageo.com/documents/recent/UPY-GPHC_X5R_4V-to-50V_12.pdf; ComponentLink2Description: http://www.yageo.com/documents/recent/UPY-GPHC_X5R_4V-to-50V_12.pdf; Supplier 3: Digi-Key; Supplier Part Number 3: 1276-1010-1-ND; Manufacturer 3: Samsung Electro-Mechanics America, Inc; Manufacturer Part Number 3: CL05A105KQ5NNNC; RoHS 3: RoHS Compliant; ComponentLink3URL: http://www.samsungsem.com/servlet/FileDownload?path=productsearch&sname=CL05A105KQ5NNNC.pdf&oname=CL05A105KQ5NNNC.pdf; ComponentLink3Description: http://www.samsungsem.com/servlet/FileDownload?path=productsearch&sname=CL05A105KQ5NNNC.pdf&oname=CL05A105KQ5NNNC.pdf; Supplier 4: Digi-Key; Supplier Part Number 4: 445-4998-1-ND; Manufacturer 4: TDK Corporation; Manufacturer Part Number 4: C1005X5R0J105K050BB; RoHS 4: RoHS Compliant; ComponentLink4URL: http://product.tdk.com/capacitor/mlcc/en/documents/mlcc_commercial_general_en.pdf; ComponentLink4Description: http://product.tdk.com/capacitor/mlcc/en/documents/mlcc_commercial_general_en.pdf; Supplier 5: Digi-Key; Supplier Part Number 5: 490-1320-1-ND; Manufacturer 5: Murata Electronics North America; Manufacturer Part Number 5: GRM155R60J105KE19D; RoHS 5: RoHS Compliant; ComponentLink5URL: http://www.murata.com/products/catalog/pdf/c02e.pdf; ComponentLink5Description: http://www.murata.com/products/catalog/pdf/c02e.pdf; Value: 1u
C53 = CAPC_2u2_0603_10V_10%: as C8 on sheet sar20-baseboard-USB; Package / Case: 0603 (1608 metric); Tolerance: ±10%; Supplier 1: Digi-Key; Supplier Part Number 1: 478-6212-1-ND; ComponentLink1URL: http://www.avx.com/docs/Catalogs/cx5r.pdf; ComponentLink1Description: http://www.avx.com/docs/Catalogs/cx5r.pdf
C56-C62 = CAPC_100n_0402_X5R_16V_10%: as C6 on sheet sar20-baseboard-USB; Tolerance: ±10%; Operating Temperature: -55°C ~ 125°C; Package / Case: 0402 (1005 Metric); Size / Dimension: 0.039" L x 0.020" W (1.00mm x 0.50mm); Supplier 1: Digi-Key; Supplier Part Number 1: 478-1126-1-ND; ComponentLink1URL: http://www.avx.com/docs/Catalogs/cx5r.pdf; ComponentLink1Description: http://www.avx.com/docs/Catalogs/cx5r.pdf; Supplier 2: Digi-Key; Supplier Part Number 2: 311-1347-1-ND; Manufacturer 2: Yageo; Manufacturer Part Number 2: CC0402KRX5R7BB104; ComponentLink2URL: http://www.yageo.com/documents/recent/UPY-GPHC_X5R_4V-to-50V_12.pdf; ComponentLink2Description: http://www.yageo.com/documents/recent/UPY-GPHC_X5R_4V-to-50V_12.pdf; Value: 100n
MP3 MP4 = 9774030633: as MP1 on sheet sar20-baseboard-SOM; ComponentLink1Description: Manufacturer; ComponentLink1URL: http://www.we-online.de; ComponentLink2Description: Datasheet; ComponentLink2URL: https://www.we-online.com/catalog/datasheet/9774030633.pdf; Mounting Technology: SMT; Packaging: Bulk; Manufacturer Part Number: 9774030633; Length: 3mm; Inner Thread Length: -; Operating Temperature: -55 to +150degC; Outer Diameter: 3.3mm; Published Date: April 2020; Material: Steel; Thread: M1.6
OSC1 = Abracon AMPM
R2 = RES_10R_0402_5%: Resistor SMD chip 10 Ohm 0.063W 5% 0402; Manufacturer 1: Yageo; Manufacturer Part Number 1: RC0402JR-0710RL; Ratings: 1/16 W; SCDType: spec; Package / Case: 0402 (1005 Metric); Tolerance: ±5%; Supplier 1: Digi-Key; Supplier Part Number 1: 311-10JRCT-ND; RoHS 1: RoHS Compliant; ComponentLink1URL: http://www.yageo.com/documents/recent/PYu-RC0402_51_RoHS_L_6.pdf; ComponentLink1Description: http://www.yageo.com/documents/recent/PYu-RC0402_51_RoHS_L_6.pdf; Supplier 2: Digi-Key; Supplier Part Number 2: RHM10CECT-ND; Manufacturer 2: Rohm Semiconductor; Manufacturer Part Number 2: MCR01MRTJ100; RoHS 2: RoHS Compliant; ComponentLink2URL: http://rohmfs.rohm.com/en/products/databook/datasheet/passive/resistor/chip_resistor/mcr_g.pdf; ComponentLink2Description: http://rohmfs.rohm.com/en/products/databook/datasheet/passive/resistor/chip_resistor/mcr_g.pdf; Supplier 3: Digi-Key; Supplier Part Number 3: 541-10JCT-ND; Manufacturer 3: Vishay Dale; Manufacturer Part Number 3: CRCW040210R0JNED; RoHS 3: RoHS Compliant; ComponentLink3URL: http://www.vishay.com/doc?20035; ComponentLink3Description: http://www.vishay.com/doc?20035; Supplier 4: Digi-Key; Supplier Part Number 4: RMCF0402JT10R0CT-ND; Manufacturer 4: Stackpole Electronics Inc; Manufacturer Part Number 4: RMCF0402JT10R0; RoHS 4: RoHS Compliant; ComponentLink4URL: http://www.seielect.com/Catalog/SEI-RMCF_RMCP.pdf; ComponentLink4Description: http://www.seielect.com/Catalog/SEI-RMCF_RMCP.pdf; Supplier 5: Digi-Key; Supplier Part Number 5: 1276-4328-1-ND; Manufacturer 5: Samsung Electro-Mechanics America, Inc; Manufacturer Part Number 5: RC1005J100CS; RoHS 5: RoHS Compliant; ComponentLink5URL: http://www.samsungsem.com/servlet/FileDownload?filename=productcatalog/pdf/Chip_Resistor.pdf; ComponentLink5Description: http://www.samsungsem.com/servlet/FileDownload?filename=productcatalog/pdf/Chip_Resistor.pdf
R13#2 = RES_10K_0402_1%: as R1 on sheet sar20-baseboard-USB; Package / Case: 0402 (1005 Metric); Manufacturer 2: Yageo; Manufacturer Part Number 2: RC0402FR-0710KL; Supplier 1: Digi-Key; Supplier Part Number 1: 541-10.0KLCT-ND; ComponentLink1URL: http://www.vishay.com/doc?20035; ComponentLink1Description: http://www.vishay.com/doc?20035; Supplier 2: Digi-Key; Supplier Part Number 2: 311-10.0KLRCT-ND; ComponentLink2URL: http://www.yageo.com/documents/recent/PYu-RC0402_51_RoHS_L_6.pdf; ComponentLink2Description: http://www.yageo.com/documents/recent/PYu-RC0402_51_RoHS_L_6.pdf; Tolerance: ±1%
U16#2 = MIC5387